# EAGLE design sensorOscillator02_v02 (EAGLE 6.5.0)
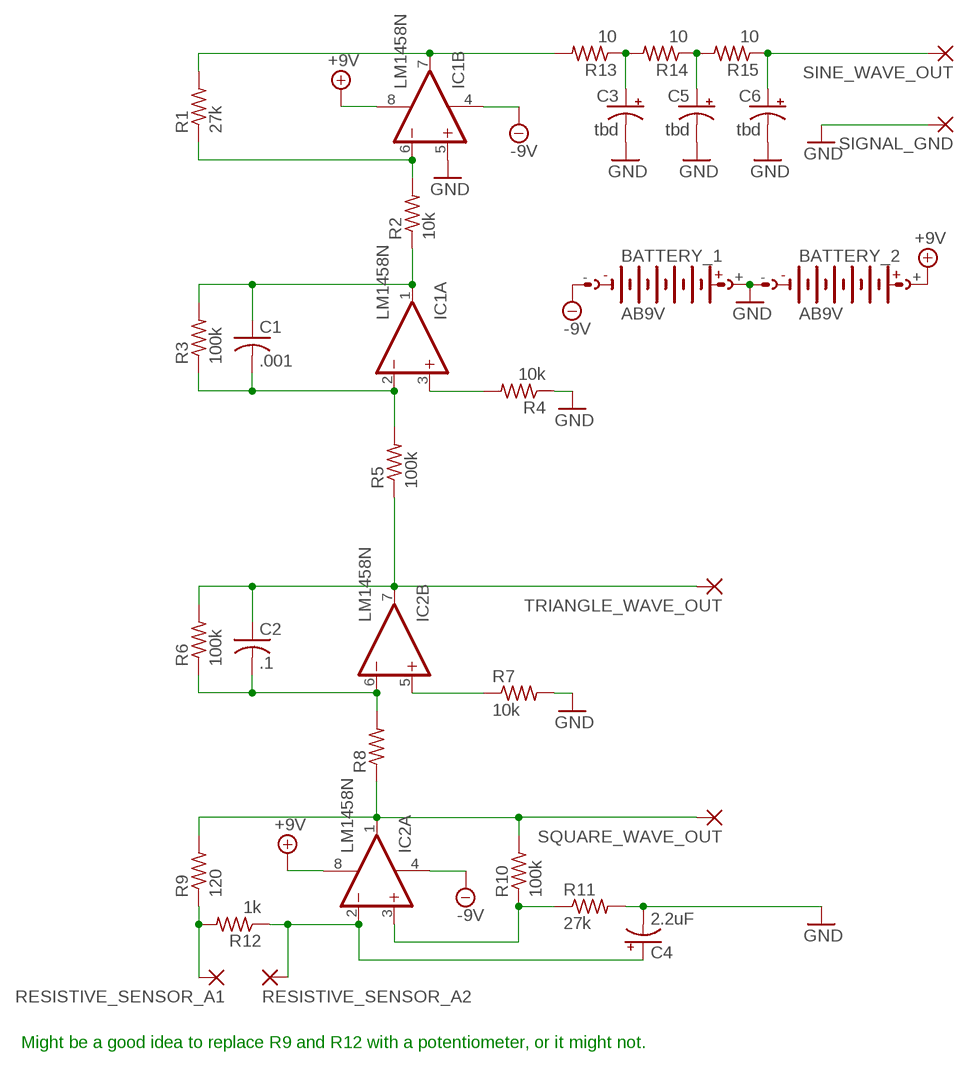
[diagram p0: schematic, sheet 1]

## Parts
BATTERY_1  AB9V  [AB9V]
BATTERY_2  AB9V  [AB9V]
C1  .001  C-US075-063X106  [C075-063X106]
C2  .1  C-US075-063X106  [C075-063X106]
C3  tbd  CPOL-USE5-5  [E5-5]
C4  2.2uF  CPOL-USE5-5  [E5-5]
C5  tbd  CPOL-USE5-5  [E5-5]
C6  tbd  CPOL-USE5-5  [E5-5]
IC1  LM1458N  [DIL08]
IC2  LM1458N  [DIL08]
R1  27k  R-US_0411/12  [0411/12]
R2  10k  R-US_0411/12  [0411/12]
R3  100k  R-US_0411/12  [0411/12]
R4  10k  R-US_0411/12  [0411/12]
R5  100k  R-US_0411/12  [0411/12]
R6  100k  R-US_0411/12  [0411/12]
R7  10k  R-US_0411/12  [0411/12]
R8  R-US_0411/12  [0411/12]
R9  120  R-US_0411/12  [0411/12]
R10  100k  R-US_0411/12  [0411/12]
R11  27k  R-US_0411/12  [0411/12]
R12  1k  R-US_0411/12  [0411/12]
R13  10  R-US_0411/12  [0411/12]
R14  10  R-US_0411/12  [0411/12]
R15  10  R-US_0411/12  [0411/12]
RESISTIVE_SENSOR_A1  3,81/1,3  [3,81/1,3]
RESISTIVE_SENSOR_A2  3,81/1,3  [3,81/1,3]
SIGNAL_GND  3,81/1,3  [3,81/1,3]
SINE_WAVE_OUT  3,81/1,3  [3,81/1,3]
SQUARE_WAVE_OUT  3,81/1,3  [3,81/1,3]
TRIANGLE_WAVE_OUT  3,81/1,3  [3,81/1,3]

## Nets
+9V: BATTERY_2.+ IC1.8(P:V+) IC2.8(P:V+)
-9V: BATTERY_1.- IC1.4(P:V-) IC2.4(P:V-)
GND: BATTERY_1.+ BATTERY_2.- C3.- C4.- C5.- C6.- IC1.5(B:+IN) R4.1 R7.2 R11.2 SIGNAL_GND.1(P)
N$1: IC1.6(B:-IN) R1.1 R2.2
N$2: C1.1 IC1.1(A:OUT) R2.1 R3.2
N$3: IC1.7(B:OUT) R1.2 R13.2
N$4: C1.2 IC1.2(A:-IN) R3.1 R5.2
N$5: IC1.3(A:+IN) R4.2
N$6: C2.1 IC2.7(B:OUT) R5.1 R6.2 TRIANGLE_WAVE_OUT.1(P)
N$7: C2.2 IC2.6(B:-IN) R6.1 R8.2
N$8: C3.+ R13.1 R14.2
N$9: IC2.1(A:OUT) R8.1 R9.2 R10.2 SQUARE_WAVE_OUT.1(P)
N$10: IC2.3(A:+IN) R10.1 R11.1
N$11: R9.1 R12.2 RESISTIVE_SENSOR_A1.1(P)
N$12: C4.+ IC2.2(A:-IN) R12.1 RESISTIVE_SENSOR_A2.1(P)
N$13: IC2.5(B:+IN) R7.1
N$14: C5.+ R14.1 R15.2
N$15: C6.+ R15.1 SINE_WAVE_OUT.1(P)

## Notes on the sheet
- Might be a good idea to replace R9 and R12 with a potentiometer, or it might not.

## Library data of the parts
BATTERY_1 BATTERY_2 = battery:AB9V: 9-V BATTERY CLIP
C1 C2 = resistor:C-US: CAPACITOR, American symbol
C3-C6 = resistor:CPOL-US: POLARIZED CAPACITOR, American symbol
IC1 IC2 = linear:*1458: OP AMP
R1-R15 = resistor:R-US_: RESISTOR, American symbol
RESISTIVE_SENSOR_A1 RESISTIVE_SENSOR_A2 SIGNAL_GND SINE_WAVE_OUT SQUARE_WAVE_OUT TRIANGLE_WAVE_OUT = wirepad:3,81/1,3: THROUGH-HOLE PAD

## Board
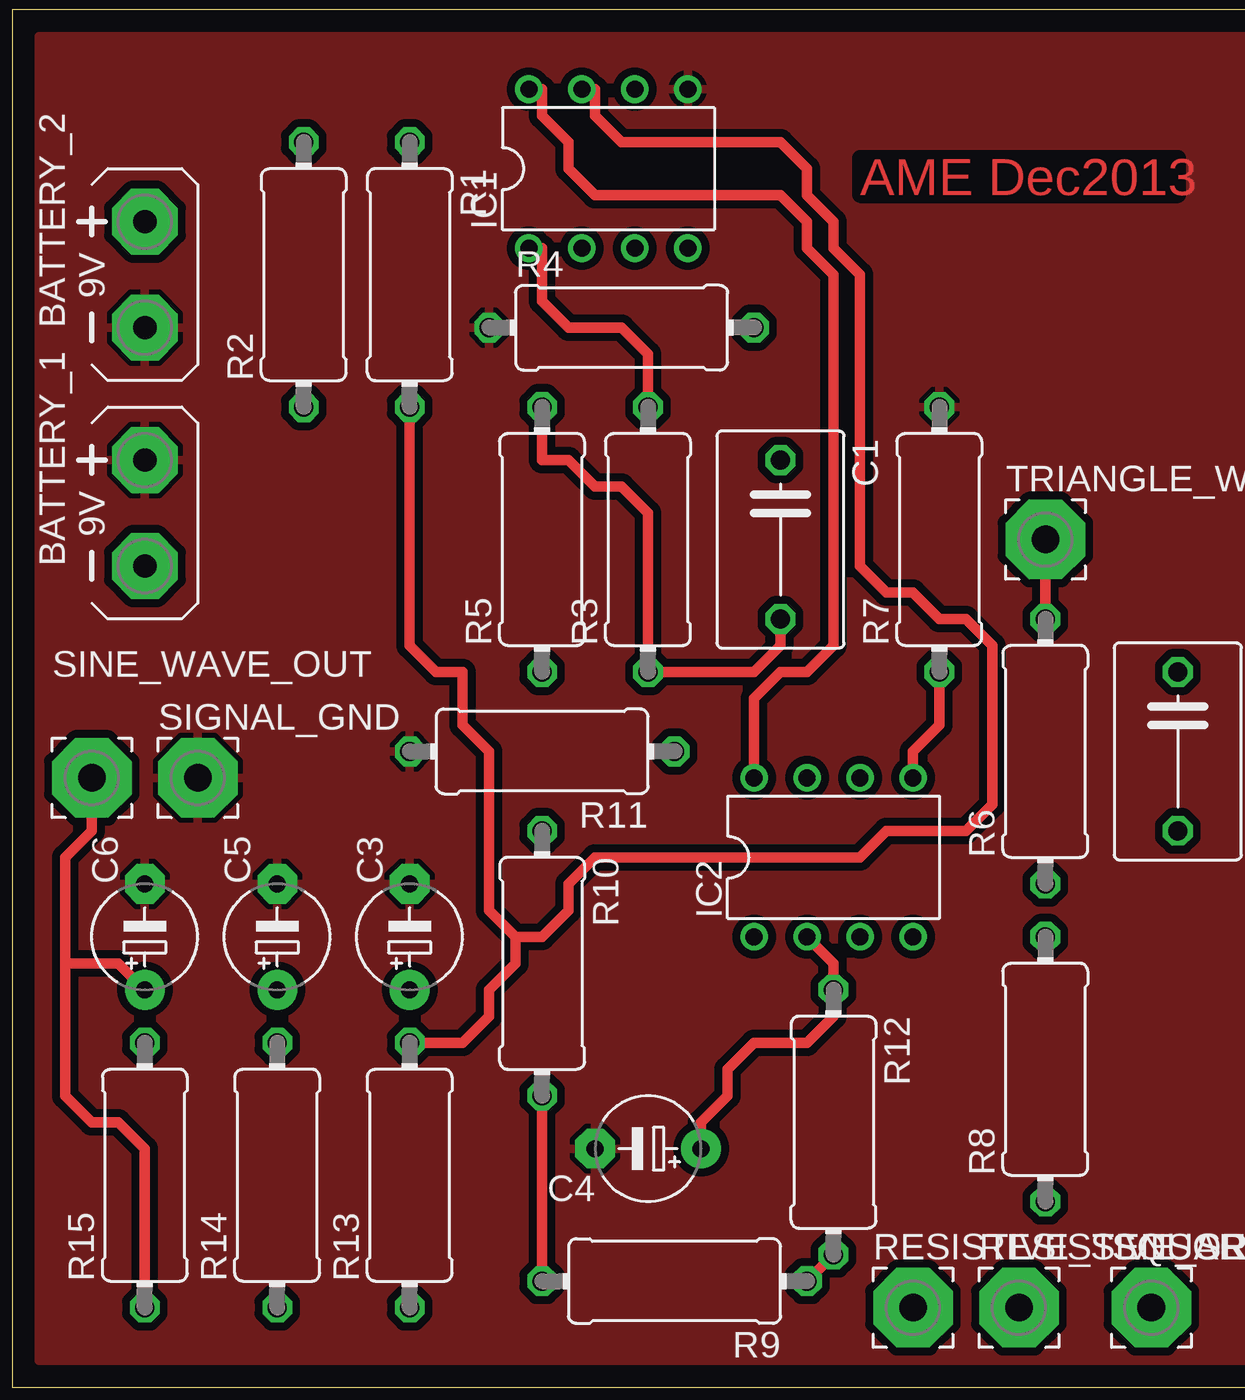
[diagram p1: board, top side]
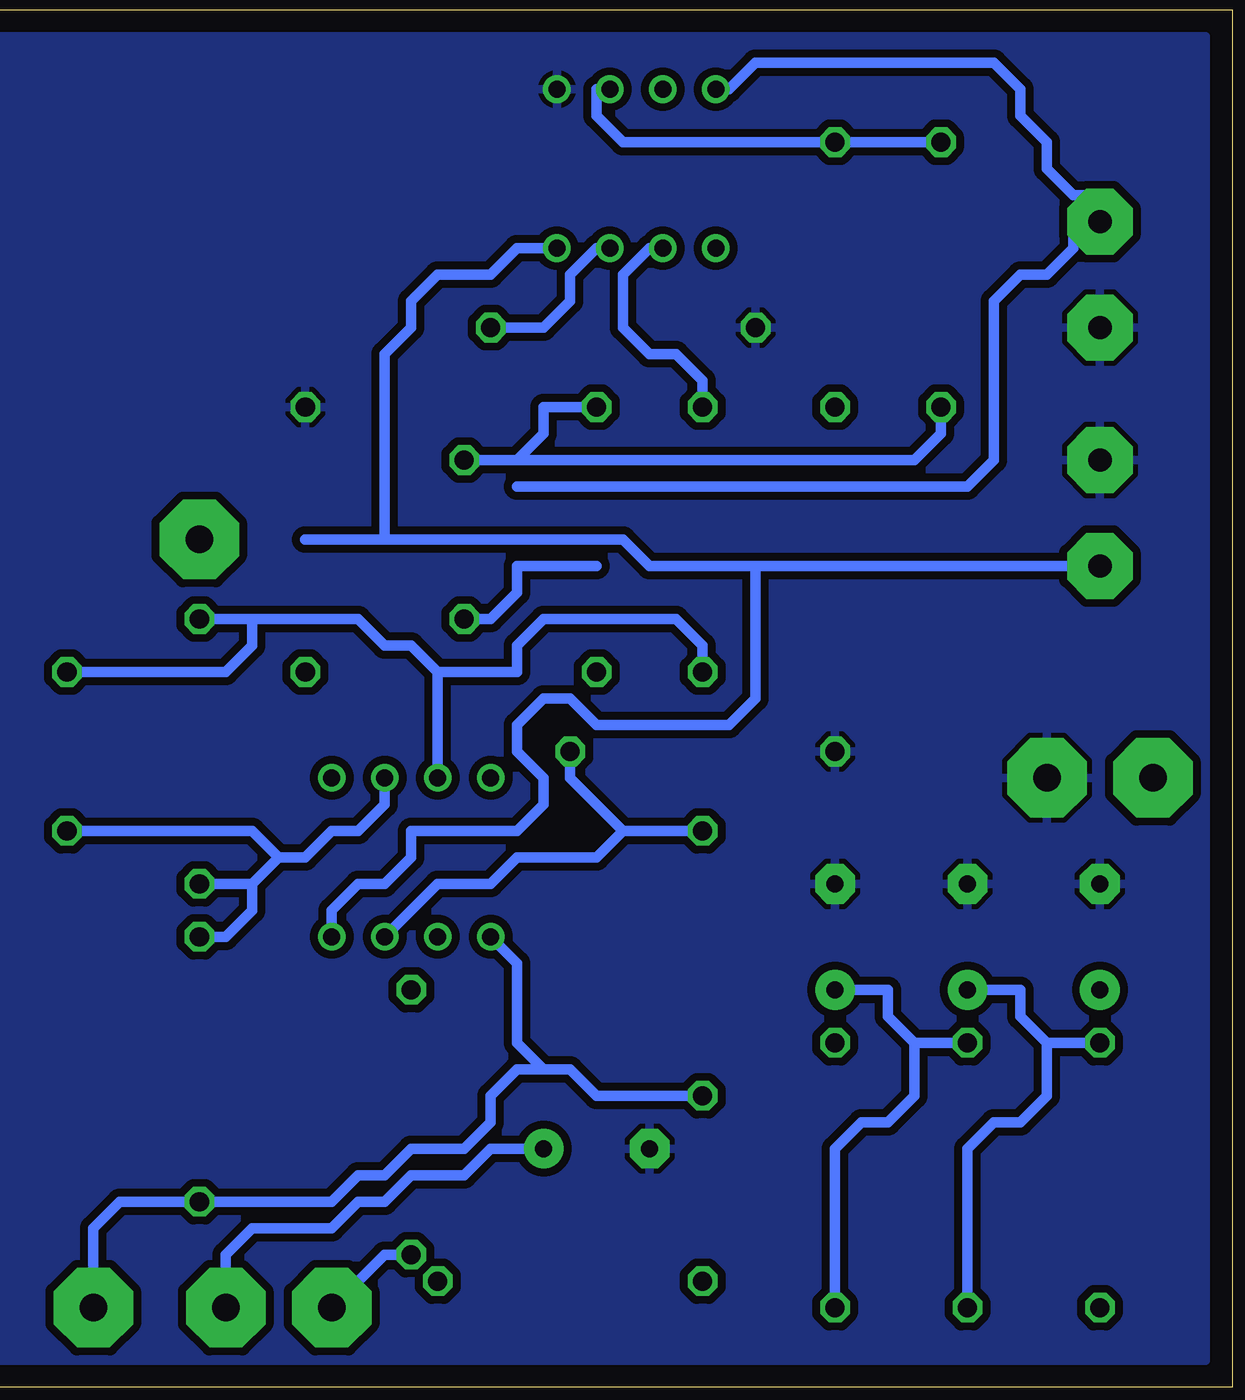
[diagram p2: board, bottom side, seen from below]

No outline drawn. Coordinates in mm, seen from the top.
Copper layers (1*16): Top 0.035mm / dielectric 1.5mm / Bottom 0.035mm
Design rules "default *": minimum track width 20mil, minimum drill 24mil, track to track 15mil, track to pad 30mil, pad to pad 15mil, via to via 15mil, smd to smd 8mil, copper to edge 40mil, drill to drill 8mil, minimum pad ring 10mil, minimum via ring 8mil, stop-mask expansion 4mil, vias tented up to drill 0mil, thermal gap 10mil
Milling: 4 lines

### Footprints (pad centres in the part's own frame; a part is rotated, then mirrored left to right if it is on the bottom)
AB9V = drill 1.118 pad 3.15 octagon: + 0,2.54; - 0,-2.54
C075-063X106 = drill 0.914 octagon: 1 -3.81,0; 2 3.81,0
E5-5 = drill 0.813 pad 1.905: + -2.54,0 | drill 0.813 pad 1.905 octagon: - 2.54,0
DIL08 = drill 0.813 pad 1.27: 1 -3.81,-3.81; 2 -1.27,-3.81; 3 1.27,-3.81; 4 3.81,-3.81; 5 3.81,3.81; 6 1.27,3.81; 7 -1.27,3.81; 8 -3.81,3.81
0411/12 = drill 0.914 octagon: 1 -6.35,0; 2 6.35,0
3,81/1,3 = drill 1.321 pad 3.81 octagon: 1 0,0

### Placement (x,y rotation side)
BATTERY_1  6.35,41.91 0 top
BATTERY_2  6.35,53.34 0 top
C1  36.83,40.64 270 top
C2  55.88,30.48 270 top
C3  19.05,21.59 90 top
C4  30.48,11.43 180 top
C5  12.7,21.59 90 top
C6  6.35,21.59 90 top
IC1  28.57,58.42 0 top
IC2  39.37,25.4 0 top
R1  19.05,53.34 270 top
R2  13.97,53.34 90 top
R3  30.48,40.64 90 top
R4  29.21,50.8 0 top
R5  25.4,40.64 90 top
R6  49.53,30.48 90 top
R7  44.45,40.64 90 top
R8  49.53,15.24 90 top
R9  31.75,5.08 180 top
R10  25.4,20.32 270 top
R11  25.4,30.48 180 top
R12  39.37,12.7 270 top
R13  19.05,10.16 90 top
R14  12.7,10.16 90 top
R15  6.35,10.16 90 top
RESISTIVE_SENSOR_A1  43.18,3.81 0 top
RESISTIVE_SENSOR_A2  48.26,3.81 0 top
SIGNAL_GND  8.89,29.21 0 top
SINE_WAVE_OUT  3.81,29.21 0 top
SQUARE_WAVE_OUT  54.61,3.81 0 top
TRIANGLE_WAVE_OUT  49.53,40.64 0 top

### Tracks (layer width: path | path; a pad name or v marks a point on that pad's centre or on a via)
+9V
  Top 0.508: IC2.8 35.56,33.02 36.83,34.29 38.1,34.29 39.37,35.56 39.37,53.34 38.1,54.61 38.1,55.88 36.83,57.15 27.94,57.15 26.67,58.42 26.67,59.69 25.4,60.96 25.4,62.23 IC1.8
  Bottom 0.508: 34.29,43.18 12.7,43.18 11.43,44.45 11.43,52.07 10.16,53.34 8.89,53.34 7.62,54.61 7.62,55.88 BATTERY_2.+ 6.35,57.15 7.62,57.15 8.89,58.42 8.89,59.69 10.16,60.96 10.16,62.23 11.43,63.5 22.86,63.5 24.13,62.23 IC1.8
-9V
  Bottom 0.508: 22.86,39.37 27.94,39.37 29.21,40.64 40.64,40.64 | 22.86,39.37 BATTERY_1.- | 44.45,40.64 40.64,40.64 | IC1.4 34.29,54.61 35.56,53.34 38.1,53.34 39.37,52.07 39.37,50.8 40.64,49.53 40.64,40.64 | IC2.4 43.18,22.86 41.91,24.13 40.64,24.13 39.37,25.4 39.37,26.67 34.29,26.67 33.02,27.94 33.02,29.21 34.29,30.48 34.29,31.75 33.02,33.02 31.75,33.02 30.48,31.75 24.13,31.75 22.86,33.02 22.86,39.37
GND
  pour Top: 1.27,64.77 59.69,64.77 59.69,1.27 1.27,1.27
  pour Bottom: 1.27,64.77 1.27,1.27 59.69,1.27 59.69,64.77
N$1
  Bottom 0.508: IC1.6 30.48,62.23 30.48,60.96 29.21,59.69 R1.1 R2.2
N$2
  Top 0.508: R3.2 30.48,49.53 29.21,50.8 26.67,50.8 25.4,52.07 25.4,54.61 IC1.1
  Bottom 0.508: 34.29,44.45 C1.1 | 34.29,44.45 33.02,45.72 33.02,46.99 R3.2 | R2.1 13.97,45.72 15.24,44.45 34.29,44.45
N$3
  Top 0.508: 24.13,21.59 25.4,21.59 26.67,22.86 26.67,24.13 27.94,25.4 40.64,25.4 41.91,26.67 45.72,26.67 46.99,27.94 46.99,35.56 45.72,36.83 44.45,36.83 43.18,38.1 41.91,38.1 40.64,39.37 40.64,53.34 39.37,54.61 39.37,55.88 38.1,57.15 38.1,58.42 36.83,59.69 29.21,59.69 27.94,60.96 27.94,62.23 IC1.7 | 24.13,21.59 24.13,20.32 22.86,19.05 22.86,17.78 21.59,16.51 R13.2 | R1.2 19.05,35.56 20.32,34.29 21.59,34.29 21.59,31.75 22.86,30.48 22.86,22.86 24.13,21.59
N$4
  Top 0.508: C1.2 36.83,35.56 35.56,34.29 R3.1 30.48,41.91 29.21,43.18 27.94,43.18 26.67,44.45 25.4,44.45 R5.2
  Bottom 0.508: R5.2 25.4,48.26 26.67,49.53 27.94,49.53 29.21,50.8 29.21,53.34 27.94,54.61 IC1.2 | C1.2 35.56,36.83 34.29,38.1 34.29,39.37 30.48,39.37
N$5
  Bottom 0.508: R4.2 33.02,50.8 31.75,52.07 31.75,53.34 30.48,54.61 IC1.3
N$6
  Top 0.508: R6.2 TRIANGLE_WAVE_OUT.1
  Bottom 0.508: 38.1,34.29 IC2.7 | 38.1,34.29 39.37,35.56 40.64,35.56 41.91,36.83 46.99,36.83 | R6.2 46.99,36.83 | R5.1 25.4,35.56 26.67,36.83 33.02,36.83 34.29,35.56 34.29,34.29 38.1,34.29 | C2.1 48.26,34.29 46.99,35.56 46.99,36.83
N$7
  Bottom 0.508: IC2.6 40.64,27.94 41.91,26.67 43.18,26.67 44.45,25.4 45.72,25.4 | 46.99,24.13 45.72,25.4 | R6.1 46.99,24.13 | R8.2 48.26,21.59 46.99,22.86 46.99,24.13 | C2.2 46.99,26.67 45.72,25.4
N$8
  Bottom 0.508: 15.24,16.51 R14.2 | 15.24,16.51 16.51,17.78 16.51,19.05 C3.+ | R13.1 19.05,11.43 17.78,12.7 16.51,12.7 15.24,13.97 15.24,16.51
N$9
  Top 0.508: R10.2 R9.2
  Bottom 0.508: IC2.1 34.29,20.32 34.29,16.51 33.02,15.24 | 33.02,15.24 31.75,15.24 30.48,13.97 R10.2 | 33.02,15.24 34.29,15.24 35.56,13.97 35.56,12.7 36.83,11.43 39.37,11.43 40.64,10.16 41.91,10.16 43.18,8.89 R8.1 53.34,8.89 54.61,7.62 SQUARE_WAVE_OUT.1
N$10
  Bottom 0.508: IC2.3 38.1,24.13 35.56,24.13 34.29,25.4 30.48,25.4 29.21,26.67 | R10.1 29.21,26.67 | R11.1 31.75,29.21 29.21,26.67
N$11
  Top 0.508: R12.2 R9.1
  Bottom 0.508: R12.2 40.64,6.35 41.91,5.08 41.91,3.81 RESISTIVE_SENSOR_A1.1
N$12
  Top 0.508: IC2.2 39.37,20.32 R12.1 39.37,17.78 38.1,16.51 35.56,16.51 34.29,15.24 34.29,13.97 33.02,12.7 C4.+
  Bottom 0.508: RESISTIVE_SENSOR_A2.1 48.26,6.35 46.99,7.62 43.18,7.62 41.91,8.89 40.64,8.89 39.37,10.16 36.83,10.16 35.56,11.43 C4.+
N$13
  Top 0.508: IC2.5 43.18,30.48 44.45,31.75 R7.1
N$14
  Bottom 0.508: 8.89,16.51 R15.2 | 8.89,16.51 10.16,17.78 10.16,19.05 C5.+ | R14.1 12.7,11.43 11.43,12.7 10.16,12.7 8.89,13.97 8.89,16.51
N$15
  Top 0.508: R15.1 6.35,11.43 5.08,12.7 3.81,12.7 2.54,13.97 2.54,20.32 | 2.54,20.32 2.54,25.4 3.81,26.67 SINE_WAVE_OUT.1 | C6.+ 5.08,20.32 2.54,20.32

### Text on the board
Top: AME Dec2013